# Altium schematic sheet ECL.SchDoc
size A4; SheetNumber: 1; SheetTotal: 1; SPICEModelCacheNPXRNONS: <root> / <DocumentId>NPXRNONS</DocumentId> / <CacheFrame Number="0"> / <Model Name="npn" Kind="MDL"> / <Text>*Default NPN BJT / *NPN Trans Pinout: C,B,E / .MODEL NPN NPN()</Text> / </Model> / <Model Name="1n5408" Kind="MDL"> / <Text>*1N5408 MCE 8/5/97 / *Ref: International Rectifier Digest '94 / *1000V 3000mA 3us Si Diode pkg:DIODE0.4 1,2 / .MODEL 1N5408 D (IS=4.26N RS=14M N=1.7 BV=1E+03 IBV=165U / + CJO=125P VJ=0.75 M=0.333 TT=4.32U)</Text> / </Model> / <Model Name="diode" Kind="MDL"> / <Text>*Default Diode / *Diode Pinout: A,K / .MODEL DIODE D()</Text> / </Model> / </CacheFrame> / </root>
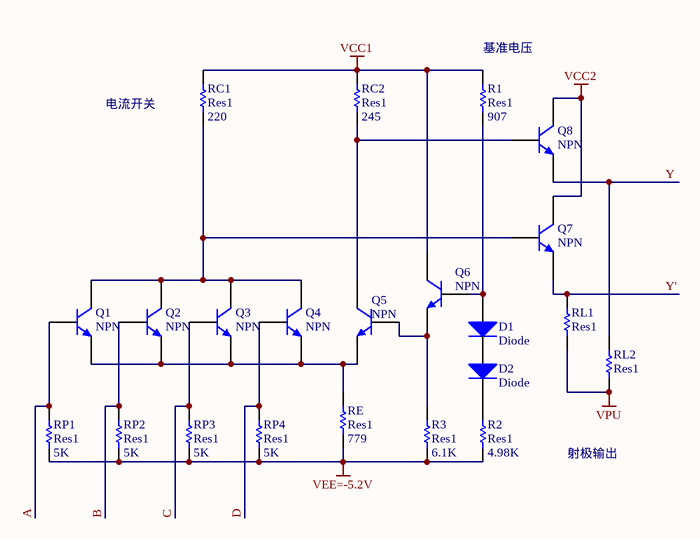
[diagram p0: ECL.SchDoc]

## Parts
D1  Diode  [SMC]
D2  Diode  [SMC]
Q1  NPN  [TO-226-AA]
Q2  NPN  [TO-226-AA]
Q3  NPN  [TO-226-AA]
Q4  NPN  [TO-226-AA]
Q5  NPN  [TO-226-AA]
Q6  NPN  [TO-226-AA]
Q7  NPN  [TO-226-AA]
Q8  NPN  [TO-226-AA]
R1  Res1  value 907  [AXIAL-0.3]
R2  Res1  value 4.98K  [AXIAL-0.3]
R3  Res1  value 6.1K  [AXIAL-0.3]
RC1  Res1  value 220  [AXIAL-0.3]
RC2  Res1  value 245  [AXIAL-0.3]
RE  Res1  value 779  [AXIAL-0.3]
RL1  Res1  [AXIAL-0.3]
RL2  Res1  [AXIAL-0.3]
RP1  Res1  value 5K  [AXIAL-0.3]
RP2  Res1  value 5K  [AXIAL-0.3]
RP3  Res1  value 5K  [AXIAL-0.3]
RP4  Res1  value 5K  [AXIAL-0.3]

## Nets
VCC1: Q6.1(C) R1.2 RC1.2 RC2.2
VCC2: Q7.1(C) Q8.1(C)
VEE=-5.2V: R2.1 R3.1 RE.1 RP1.1 RP2.1 RP3.1 RP4.1
VPU: RL1.1 RL2.1
A: Q1.2(B) RP1.2
B: Q2.2(B) RP2.2
C: Q3.2(B) RP3.2
D: Q4.2(B) RP4.2
Y: Q8.3(E) RL2.2
Y': Q7.3(E) RL1.2
NetD1_1: D1.1(A) Q6.2(B) R1.1
NetD2_2: D2.2(K) R2.2
NetQ1_1: Q1.1(C) Q2.1(C) Q3.1(C) Q4.1(C) Q7.2(B) RC1.1
NetQ1_3: Q1.3(E) Q2.3(E) Q3.3(E) Q4.3(E) Q5.3(E) RE.2
NetQ5_1: Q5.1(C) Q8.2(B) RC2.1
NetQ5_2: Q5.2(B) Q6.3(E) R3.2

Not connected (* = marked no-connect by the designer): D1 2(K); D2 1(A)

## Notes on the sheet
- (near R1) 基准电压
- 电流开关
- 射极输出

## Library data of the parts
D1 D2 = Diode: Default Diode; Published: 8-Jun-2000; LatestRevisionDate: 17-Jul-2002; LatestRevisionNote: Re-released for DXP Platform.; PackageVersion: Sep-1996; PackageReference: SMC; Publisher: Altium Limited; PackageDescription: DO-214-AB/SMC; 2 C-Bend Leads; Body 7.9 x 5.9 mm, inc. leads (LxW); Code_JEDEC: DO-214-AB
Q1-Q8 = NPN: NPN Bipolar Transistor; Published: 8-Jun-2000; LatestRevisionDate: 17-Jul-2002; LatestRevisionNote: Re-released for DXP Platform.; PackageReference: TO-226-AA; Publisher: Altium Limited; PackageDescription: TO, Flat Index; 3 In-Line, Axial Leads; Body Dia. 4.8mm; Leads 0.55 x 0.51 mm (max); Code_JEDEC: TO-226-AA
R1-R3 RC1 RC2 RE RP1-RP4 = Res1: Resistor; Published: 8-Jun-2000; LatestRevisionDate: 17-Jul-2002; LatestRevisionNote: Re-released for DXP Platform.; PackageReference: AXIAL-0.3; Publisher: Altium Limited; PackageDescription: Axial Device, Thru-Hole; 2 Leads; 0.3 in Pin Spacing
RL1 RL2 = Res1: Resistor; Value: 1K; Published: 8-Jun-2000; LatestRevisionDate: 17-Jul-2002; LatestRevisionNote: Re-released for DXP Platform.; PackageReference: AXIAL-0.3; Publisher: Altium Limited; PackageDescription: Axial Device, Thru-Hole; 2 Leads; 0.3 in Pin Spacing